# Altium project licheepi_nano_pcb.PrjPcb
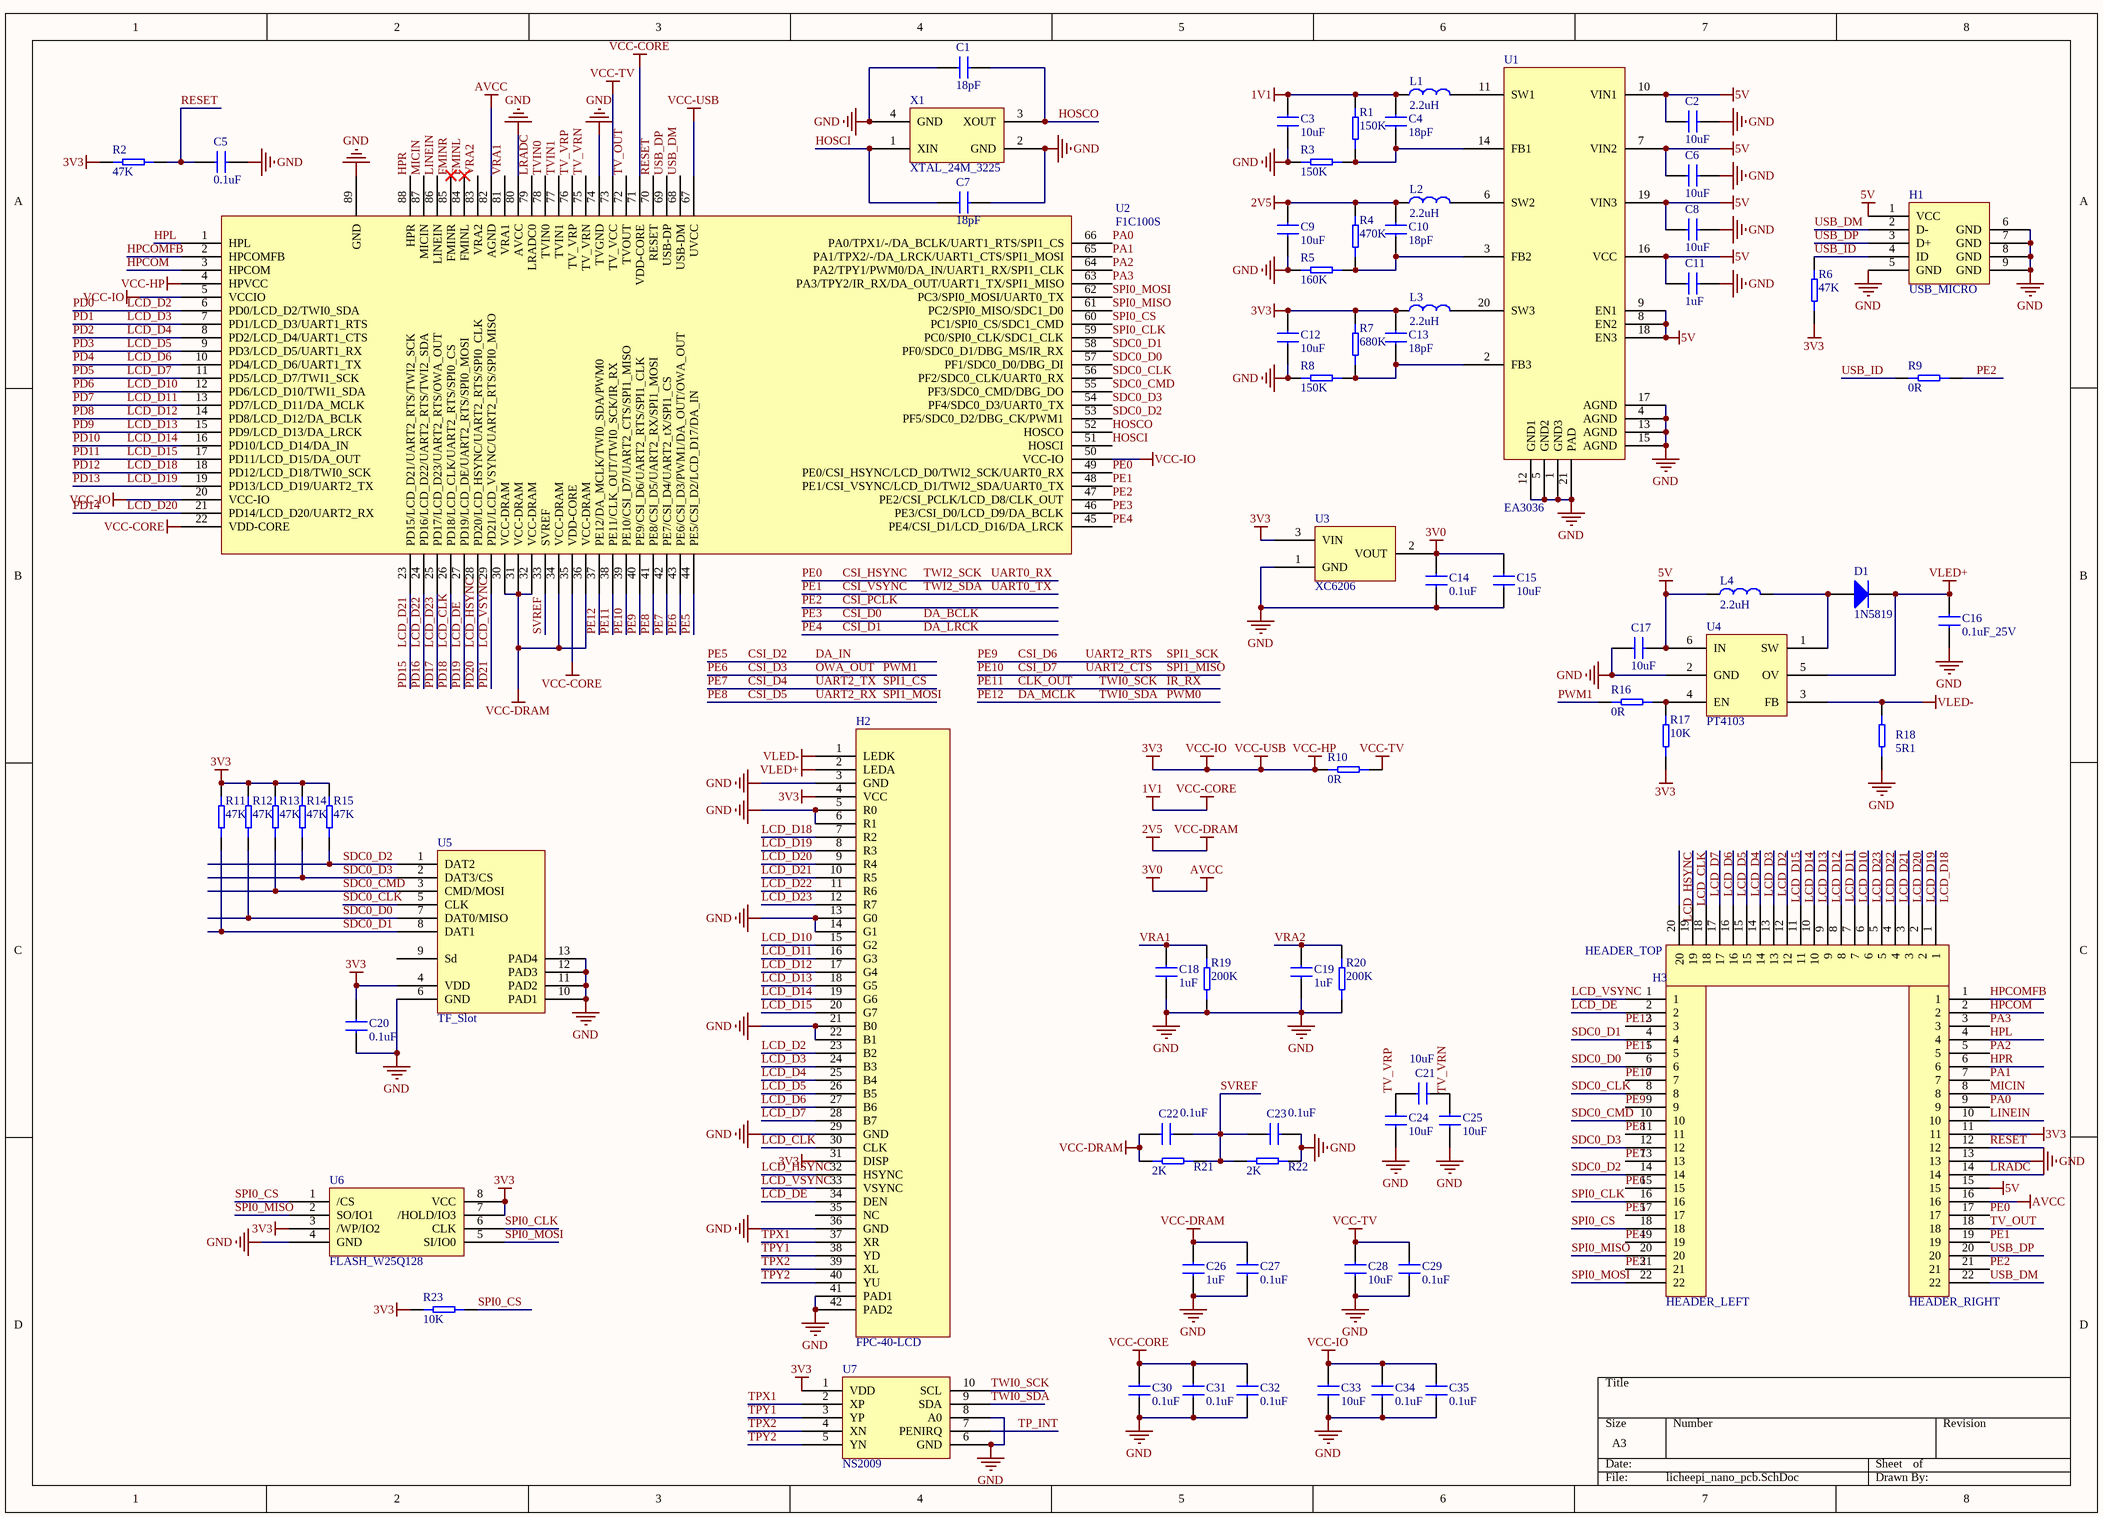
[diagram p0: licheepi_nano_pcb.SchDoc]
1 sheet, 76 parts. Net scope: global (net labels, ports and power ports of the same name join across sheets).
Board file: licheepi_nano_pcb.PcbDoc

## Sheet licheepi_nano_pcb.SchDoc
size A3

### Parts
C1  18pF  [0402C]
C2  10uF  [0402C]
C3  10uF  [0402C]
C4  18pF  [0402C]
C5  0.1uF  [0402C]
C6  10uF  [0402C]
C7  18pF  [0402C]
C8  10uF  [0402C]
C9  10uF  [0402C]
C10  18pF  [0402C]
C11  1uF  [0402C]
C12  10uF  [0402C]
C13  18pF  [0402C]
C14  0.1uF  [0402C]
C15  10uF  [0402C]
C16  0.1uF_25V  [0402C]
C17  10uF  [0402C]
C18  1uF  [0402C]
C19  1uF  [0402C]
C20  0.1uF  [0402C]
C21  10uF  [0402C]
C22  0.1uF  [0402C]
C23  0.1uF  [0402C]
C24  10uF  [0402C]
C25  10uF  [0402C]
C26  1uF  [0402C]
C27  0.1uF  [0402C]
C28  10uF  [0402C]
C29  0.1uF  [0402C]
C30  0.1uF  [0402C]
C31  0.1uF  [0402C]
C32  0.1uF  [0402C]
C33  10uF  [0402C]
C34  0.1uF  [0402C]
C35  0.1uF  [0402C]
D1  1N5819  [SOD123]
H1  USB_MICRO  [USB_MICRO_insert]
H2  FPC-40-LCD  [FPC-40P-0.5]
H3  HEADER_TOP  [SIP20_1.27_half]
H4  HEADER_LEFT  [SIP22_10_1.27-mir]
H5  HEADER_RIGHT  [SIP22_10_1.27]
L1  2.2uH  [CD32]
L2  2.2uH  [CD32]
L3  2.2uH  [CD32]
L4  2.2uH  [CD32]
R1  150K  [0402R]
R2  47K  [0402R]
R3  150K  [0402R]
R4  470K  [0402R]
R5  160K  [0402R]
R6  47K  [0402R]
R7  680K  [0402R]
R8  150K  [0402R]
R9  0R  [0402R]
R10  0R  [0402R]
R11  47K  [0402R]
R12  47K  [0402R]
R13  47K  [0402R]
R14  47K  [0402R]
R15  47K  [0402R]
R16  0R  [0402R]
R17  10K  [0402R]
R18  5R1  [0402R]
R19  200K  [0402R]
R20  200K  [0402R]
R21  2K  [0402R]
R22  2K  [0402R]
R23  10K  [0402R]
U1  EA3036  [QFN20-3x3]
U2  F1C100S  [QFN88-0.4]
U3  XC6206  [SOT-23]
U4  PT4103  [sot23_6]
U5  TF_Slot  [TF_self-eject]
U6  FLASH_W25Q128  [SO-8M]
U7  NS2009  [MSOP10]
X1  XTAL_24M_3225  [SMD_3225]

### Nets
1V1: C3.1 C4.1 C30.1 C31.1 C32.1 L1.2 R1.2 U2.22(VDD-CORE) U2.35(VDD-CORE) U2.71(VDD-CORE)  [also labelled VCC-CORE]
2V5: C9.1 C10.1 C22.1 C26.1 C27.1 L2.2 R4.2 R21.2 U2.30(VCC-DRAM) U2.31(VCC-DRAM) U2.32(VCC-DRAM) U2.34(VCC-DRAM) U2.36(VCC-DRAM)  [also labelled VCC-DRAM]
3V0: C14.1 C15.1 H5.16 U2.82(AGND) U3.2(VOUT)  [also labelled AVCC]
3V3: C12.1 C13.1 C20.1 C33.1 C34.1 C35.1 H2.4(VCC) H2.31(DISP) H5.11 L3.2 R2.1 R6.1 R7.2 R10.1 R11.2 R12.2 R13.2 R14.2 R15.2 R17.1 R23.1 U2.4(HPVCC) U2.5(VCCIO) U2.20(VCC-IO) U2.50(VCC-IO) U2.67(UVCC) U3.3(VIN) U5.4(VDD) U6.3(/WP/IO2) U6.7(/HOLD/IO3) U6.8(VCC) U7.1(VDD)  [also labelled VCC-HP, VCC-IO, VCC-USB]
5V: C2.1 C6.1 C8.1 C11.1 C17.2 H1.1(VCC) H5.15 L4.2 U1.7(VIN2) U1.8(EN2) U1.9(EN1) U1.10(VIN1) U1.16(VCC) U1.18(EN3) U1.19(VIN3) U4.6(IN)
GND: C1.1 C2.2 C3.2 C5.2 C6.2 C7.2 C8.2 C9.2 C11.2 C12.2 C14.2 C15.2 C16.2 C17.1 C18.2 C19.2 C20.2 C23.2 C24.2 C25.2 C26.2 C27.2 C28.2 C29.2 C30.2 C31.2 C32.2 C33.2 C34.2 C35.2 H1.5(GND) H1.6(GND) H1.7(GND) H1.8(GND) H1.9(GND) H2.3(GND) H2.5(R0) H2.6(R1) H2.13(G0) H2.14(G1) H2.21(B0) H2.22(B1) H2.29(GND) H2.36(GND) H2.41(PAD1) H2.42(PAD2) H5.13 R3.1 R5.1 R8.1 R18.1 R19.1 R20.1 R22.1 U1.1(GND3) U1.4(AGND) U1.5(GND2) U1.12(GND1) U1.13(AGND) U1.15(AGND) U1.17(AGND) U1.21(PAD) U2.74(TVGND) U2.80(AVCC) U2.89(GND) U3.1(GND) U4.2(GND) U5.6(GND) U5.10(PAD1) U5.11(PAD2) U5.12(PAD3) U5.13(PAD4) U6.4(GND) U7.6(GND) U7.8(A0) X1.2(GND) X1.4(GND)
VCC-TV: C28.1 C29.1 R10.2 U2.73(TV_VCC)
VLED+: C16.1 D1.2(K) H2.2(LEDA) U4.5(OV)
VLED-: H2.1(LEDK) R18.2 U4.3(FB)
CLK_OUT: H4.5 U2.38(PE11/CLK_OUT/TWI0_SCK/IR_RX) U7.10(SCL)  [also labelled IR_RX, PE11, TWI0_SCK]
CSI_D0: H4.21 U2.46(PE3/CSI_D0/LCD_D9/DA_BCLK)  [also labelled DA_BCLK, PE3]
CSI_D1: H4.19 U2.45(PE4/CSI_D1/LCD_D16/DA_LRCK)  [also labelled DA_LRCK, PE4]
CSI_D2: H4.17 U2.44(PE5/CSI_D2/LCD_D17/DA_IN)  [also labelled DA_IN, PE5]
CSI_D3: H4.15 R16.1 U2.43(PE6/CSI_D3/PWM1/DA_OUT/OWA_OUT)  [also labelled OWA_OUT, PE6, PWM1]
CSI_D4: H4.13 U2.42(PE7/CSI_D4/UART2_tX/SPI1_CS)  [also labelled PE7, SPI1_CS, UART2_TX]
CSI_D5: H4.11 U2.41(PE8/CSI_D5/UART2_RX/SPI1_MOSI)  [also labelled PE8, SPI1_MOSI, UART2_RX]
CSI_D6: H4.9 U2.40(PE9/CSI_D6/UART2_RTS/SPI1_CLK)  [also labelled PE9, SPI1_SCK, UART2_RTS]
CSI_D7: H4.7 U2.39(PE10/CSI_D7/UART2_CTS/SPI1_MISO)  [also labelled PE10, SPI1_MISO, UART2_CTS]
CSI_HSYNC: H5.17 U2.49(PE0/CSI_HSYNC/LCD_D0/TWI2_SCK/UART0_RX)  [also labelled PE0, TWI2_SCK, UART0_RX]
CSI_PCLK: H5.21 R9.2 U2.47(PE2/CSI_PCLK/LCD_D8/CLK_OUT)  [also labelled PE2]
CSI_VSYNC: H5.19 U2.48(PE1/CSI_VSYNC/LCD_D1/TWI2_SDA/UART0_TX)  [also labelled PE1, TWI2_SDA, UART0_TX]
DA_MCLK: H4.3 U2.37(PE12/DA_MCLK/TWI0_SDA/PWM0) U7.9(SDA)  [also labelled PE12, PWM0, TWI0_SDA]
FMINL: U2.84(FMINL)
FMINR: U2.85(FMINR)
HOSCI: C7.1 U2.51(HOSCI) X1.1(XIN)
HOSCO: C1.2 U2.52(HOSCO) X1.3(XOUT)
HPCOM: H5.2 U2.3(HPCOM)
HPCOMFB: H5.1 U2.2(HPCOMFB)
HPL: H5.4 U2.1(HPL)
HPR: H5.6 U2.88(HPR)
LCD_CLK: H2.30(CLK) H3.19 U2.26(PD18/LCD_CLK/UART2_RTS/SPI0_CS)  [also labelled PD18]
LCD_D2: H2.23(B2) H3.13 U2.6(PD0/LCD_D2/TWI0_SDA)  [also labelled PD0]
LCD_D3: H2.24(B3) H3.14 U2.7(PD1/LCD_D3/UART1_RTS)  [also labelled PD1]
LCD_D4: H2.25(B4) H3.15 U2.8(PD2/LCD_D4/UART1_CTS)  [also labelled PD2]
LCD_D5: H2.26(B5) H3.16 U2.9(PD3/LCD_D5/UART1_RX)  [also labelled PD3]
LCD_D6: H2.27(B6) H3.17 U2.10(PD4/LCD_D6/UART1_TX)  [also labelled PD4]
LCD_D7: H2.28(B7) H3.18 U2.11(PD5/LCD_D7/TWI1_SCK)  [also labelled PD5]
LCD_D10: H2.15(G2) H3.7 U2.12(PD6/LCD_D10/TWI1_SDA)  [also labelled PD6]
LCD_D11: H2.16(G3) H3.8 U2.13(PD7/LCD_D11/DA_MCLK)  [also labelled PD7]
LCD_D12: H2.17(G4) H3.9 U2.14(PD8/LCD_D12/DA_BCLK)  [also labelled PD8]
LCD_D13: H2.18(G5) H3.10 U2.15(PD9/LCD_D13/DA_LRCK)  [also labelled PD9]
LCD_D14: H2.19(G6) H3.11 U2.16(PD10/LCD_D14/DA_IN)  [also labelled PD10]
LCD_D15: H2.20(G7) H3.12 U2.17(PD11/LCD_D15/DA_OUT)  [also labelled PD11]
LCD_D18: H2.7(R2) H3.1 U2.18(PD12/LCD_D18/TWI0_SCK)  [also labelled PD12]
LCD_D19: H2.8(R3) H3.2 U2.19(PD13/LCD_D19/UART2_TX)  [also labelled PD13]
LCD_D20: H2.9(R4) H3.3 U2.21(PD14/LCD_D20/UART2_RX)  [also labelled PD14]
LCD_D21: H2.10(R5) H3.4 U2.23(PD15/LCD_D21/UART2_RTS/TWI2_SCK)  [also labelled PD15]
LCD_D22: H2.11(R6) H3.5 U2.24(PD16/LCD_D22/UART2_RTS/TWI2_SDA)  [also labelled PD16]
LCD_D23: H2.12(R7) H3.6 U2.25(PD17/LCD_D23/UART2_RTS/OWA_OUT)  [also labelled PD17]
LCD_DE: H2.34(DEN) H4.2 U2.27(PD19/LCD_DE/UART2_RTS/SPI0_MOSI)  [also labelled PD19]
LCD_HSYNC: H2.32(HSYNC) H3.20 U2.28(PD20/LCD_HSYNC/UART2_RTS/SPI0_CLK)  [also labelled PD20]
LCD_VSYNC: H2.33(VSYNC) H4.1 U2.29(PD21/LCD_VSYNC/UART2_RTS/SPI0_MISO)  [also labelled PD21]
LINEIN: H5.10 U2.86(LINEIN)
LRADC: H5.14 U2.79(LRADC0)
MICIN: H5.8 U2.87(MICIN)
PA0: H5.9 U2.66(PA0/TPX1/-/DA_BCLK/UART1_RTS/SPI1_CS)
PA1: H5.7 U2.65(PA1/TPX2/-/DA_LRCK/UART1_CTS/SPI1_MOSI)
PA2: H5.5 U2.64(PA2/TPY1/PWM0/DA_IN/UART1_RX/SPI1_CLK)
PA3: H5.3 U2.63(PA3/TPY2/IR_RX/DA_OUT/UART1_TX/SPI1_MISO)
RESET: C5.1 H5.12 R2.2 U2.70(RESET)
SDC0_CLK: H4.8 U2.56(PF2/SDC0_CLK/UART0_RX) U5.5(CLK)
SDC0_CMD: H4.10 R13.1 U2.55(PF3/SDC0_CMD/DBG_DO) U5.3(CMD/MOSI)
SDC0_D0: H4.6 R12.1 U2.57(PF1/SDC0_D0/DBG_DI) U5.7(DAT0/MISO)
SDC0_D1: H4.4 R11.1 U2.58(PF0/SDC0_D1/DBG_MS/IR_RX) U5.8(DAT1)
SDC0_D2: H4.14 R15.1 U2.53(PF5/SDC0_D2/DBG_CK/PWM1) U5.1(DAT2)
SDC0_D3: H4.12 R14.1 U2.54(PF4/SDC0_D3/UART0_TX) U5.2(DAT3/CS)
SPI0_CLK: H4.16 U2.59(PC0/SPI0_CLK/SDC1_CLK) U6.6(CLK)
SPI0_CS: H4.18 R23.2 U2.60(PC1/SPI0_CS/SDC1_CMD) U6.1(/CS)
SPI0_MISO: H4.20 U2.61(PC2/SPI0_MISO/SDC1_D0) U6.2(SO/IO1)
SPI0_MOSI: H4.22 U2.62(PC3/SPI0_MOSI/UART0_TX) U6.5(SI/IO0)
SVREF: C22.2 C23.1 R21.1 R22.2 U2.33(SVREF)
TP_INT: U7.7(PENIRQ)
TPX1: H2.37(XR) U7.2(XP)
TPX2: H2.39(XL) U7.4(XN)
TPY1: H2.38(YD) U7.3(YP)
TPY2: H2.40(YU) U7.5(YN)
TV_OUT: H5.18 U2.72(TVOUT)
TV_VRN: C21.2 C25.1 U2.75(TV_VRN)
TV_VRP: C21.1 C24.1 U2.76(TV_VRP)
TVIN0: U2.78(TVIN0)
TVIN1: U2.77(TVIN1)
USB_DM: H1.2(D-) H5.22 U2.68(USB-DM)
USB_DP: H1.3(D+) H5.20 U2.69(USB-DP)
USB_ID: H1.4(ID) R6.2 R9.1
VRA1: C18.1 R19.2 U2.81(VRA1)
VRA2: C19.1 R20.2 U2.83(VRA2)
NetC4_2: C4.2 R1.1 R3.2 U1.14(FB1)
NetC10_2: C10.2 R4.1 R5.2 U1.3(FB2)
NetC13_2: C13.2 R7.1 R8.2 U1.2(FB3)
NetD1_1: D1.1(A) L4.1 U4.1(SW)
NetL1_1: L1.1 U1.11(SW1)
NetL2_1: L2.1 U1.6(SW2)
NetL3_1: L3.1 U1.20(SW3)
NetR16_2: R16.2 R17.2 U4.4(EN)

Not connected (* = marked no-connect by the designer): H2 35(NC); U5 9(Sd)

### Library data of the parts
C1-C35 = CAP: SMD-CAP
L1-L4 = L1: 电感
R1-R23 = R